# Altium schematic sheet Motor.SchDoc
size A4
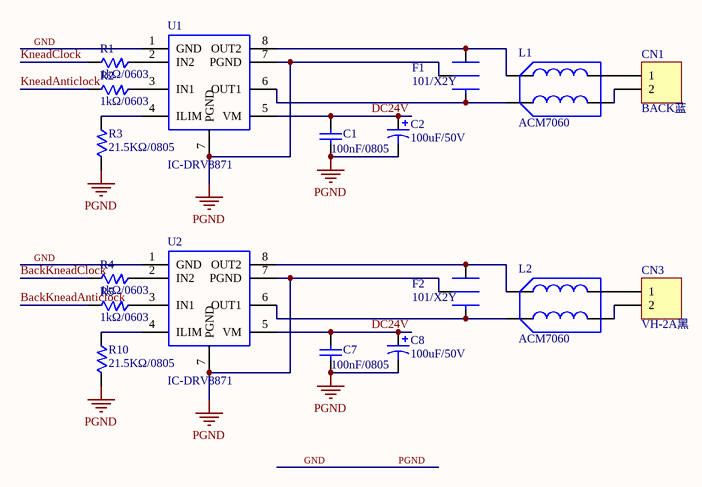
[diagram p0: Motor.SchDoc]

## Parts
C1  100nF/0805  [0805C]
C2  100uF/50V  [RB.15/.35]
C7  100nF/0805  [0805C]
C8  100uF/50V  [RB.15/.35]
CN1  BACK蓝  [CON-VH-2P]
CN3  VH-2A黑  [CON-VH-2P]
F1  101/X2Y  [X2Y]
F2  101/X2Y  [X2Y]
L1  ACM7060  [TLDCM7161]
L2  ACM7060  [TLDCM7161]
R1  1kΩ/0603  [0603]
R2  1kΩ/0603  [0603]
R3  21.5KΩ/0805  [0603]
R4  1kΩ/0603  [0603]
R5  1kΩ/0603  [0603]
R10  21.5KΩ/0805  [0603]
U1  IC-DRV8871  [DRV8871]
U2  IC-DRV8871  [DRV8871]

## Nets
GND: C1.1 C2.2 C7.1 C8.2 F1.3 F2.3 R3.1 R10.1 U1.1(GND) U1.7(PGND) U2.1(GND) U2.7(PGND)  [also labelled PGND]
BackKneadAnticlock: R5.1
BackKneadClock: R4.1
DC24V: C1.2 C2.1 C7.2 C8.1 U1.5(VM) U2.5(VM)
KneadAnticlock: R2.1
KneadClock: R1.1
NetCN1_1: CN1.1 L1.3
NetCN1_2: CN1.2 L1.4
NetCN3_1: CN3.1 L2.3
NetCN3_2: CN3.2 L2.4
NetF1_1: F1.1 L1.2 U1.8(OUT2)
NetF1_2: F1.2 L1.1 U1.6(OUT1)
NetF2_1: F2.1 L2.2 U2.8(OUT2)
NetF2_2: F2.2 L2.1 U2.6(OUT1)
NetR1_2: R1.2 U1.2(IN2)
NetR2_2: R2.2 U1.3(IN1)
NetR3_2: R3.2 U1.4(ILIM)
NetR4_2: R4.2 U2.2(IN2)
NetR5_2: R5.2 U2.3(IN1)
NetR10_2: R10.2 U2.4(ILIM)

## Notes on the sheet
- 上海荣泰健康科技股份有限公司
- 设计
- 评审
- 审核
- 版本
- 日期

## Library data of the parts
C1 C7 = C0805/104M: 物料名称: 贴片电容104M/50V/0805封装/20%/X7R/环保; 物料编号: 1.01.25.003; 领料单位: 电子车间; 单位: 个; 仓库/库位: 内5X
C2 C8 = CD/100uF/50V: 物料名称: 电解电容100uF/50V/8*11/编带/环保; 物料编号: 1.01.21.024; 领料单位: 电子车间; 单位: 个; 仓库/库位: 内5X
CN1 = CON-VH-2A(蓝色): 物料名称: 大直脚VH-2A(蓝色)/环保; 物料编号: 1.01.57.504; 领料单位: 电子车间; 单位: 个; 仓库/库位: 内5X
CN3 = CON-VH-2A(黑色): 物料名称: 大直脚VH-2A(黑色)/环保; 物料编号: 1.01.57.503; 领料单位: 电子车间; 单位: 个; 仓库/库位: 内5X
F1 F2 = CX2Y/101: 物料名称: X2Y电容/101X15W103MV4E/环保; 物料编号: 1.01.51.073; 领料单位: 电子车间; 单位: 个; 仓库/库位: 内5X
L1 L2 = L/ACM7060: 物料名称: 贴片共模电感/ACM7060-701-2PL-TL-01/7060封装/环保; 物料编号: 1.01.51.077; 领料单位: 电子车间; 单位: 个; 仓库/库位: 内5X
R1 R2 R4 R5 = R0603/1kΩ: 物料编号: 1.01.15.111; 物料名称: 贴片电阻1K/(5%)/0603封装/环保; 领料单位: 电子车间; 单位: 个; 仓库/库位: 内5X
R3 R10 = R0603/21.5KΩ 1%: 物料编号: 新物料; 物料名称: 贴片电阻21.5KΩ/0603封装/精度1%/环保; 领料单位: 电子车间; 仓库/库位: 内5X
U1 U2 = IC-DRV8871: 物料名称: 电机H型驱动芯片/DRV8871; 物料编号: 1.01.45.595; 领料单位: 电子车间; 单位: 个; 仓库/库位: 内5X